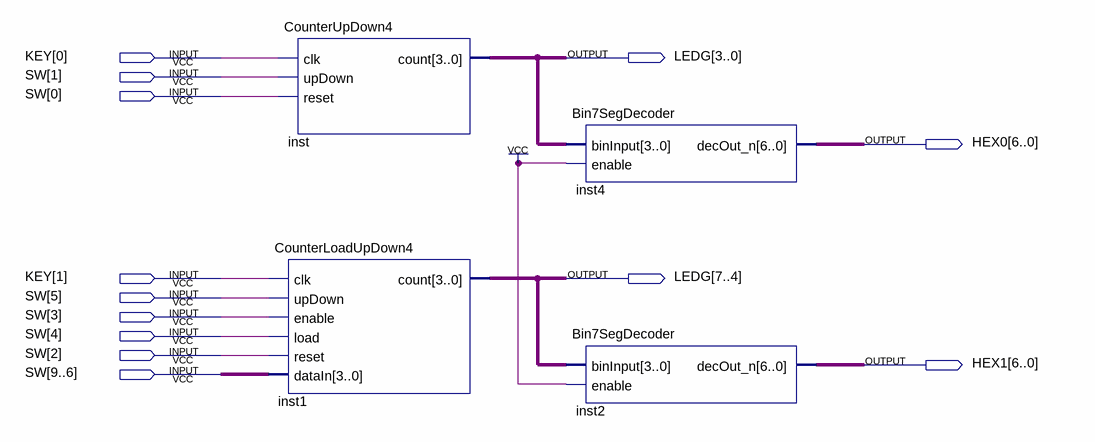
[diagram p0: schematic sheet]
// Quartus schematic CounterDemo.bdf as structural Verilog: 4 symbols, 13 pins
module CounterDemo (
  input  [1:0] KEY,
  input  [9:0] SW,
  output [7:0] LEDG,
  output [6:0] HEX0,
  output [6:0] HEX1
);

  CounterUpDown4 inst (.clk(KEY[0]), .upDown(SW[1]), .reset(SW[0]), .count(LEDG[3:0]));
  CounterLoadUpDown4 inst1 (
    .clk(KEY[1]), .upDown(SW[5]), .enable(SW[3]), .load(SW[4]), .reset(SW[2]), .dataIn(SW[9:6]),
    .count(LEDG[7:4]));
  Bin7SegDecoder inst4 (.binInput(LEDG[3:0]), .enable(1'b1), .decOut_n(HEX0));
  Bin7SegDecoder inst2 (.binInput(LEDG[7:4]), .enable(1'b1), .decOut_n(HEX1));
endmodule
